# Altium schematic sheet PowerDelivery.SchDoc
size A
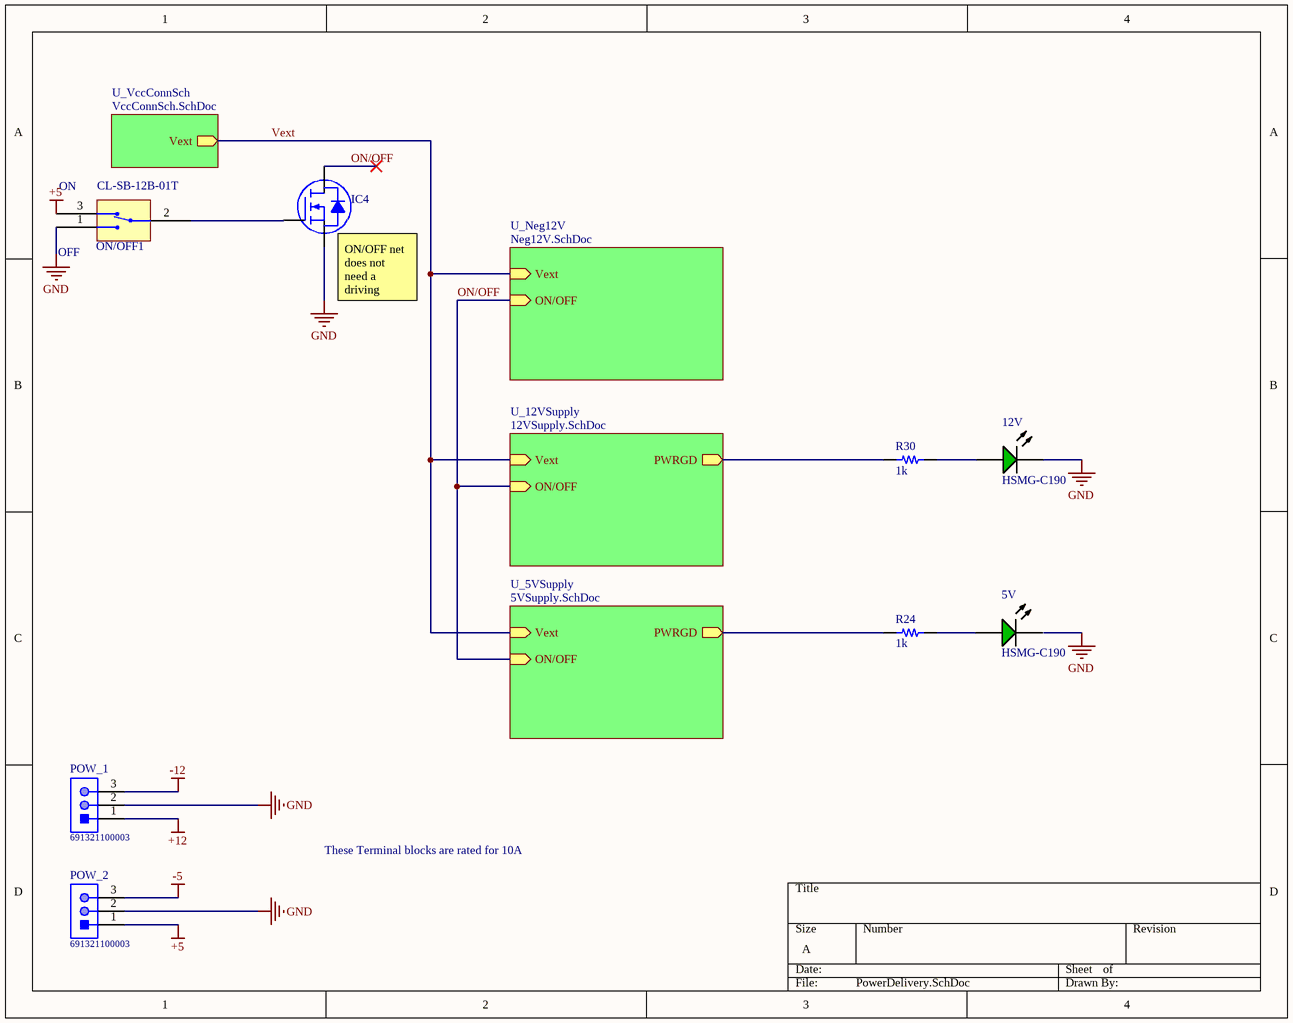
[diagram p0: PowerDelivery.SchDoc]

## Parts
5V  HSMG-C190  [AVAG-HSMX-C190_V]
12V  HSMG-C190  [AVAG-HSMX-C190_V]
IC4  BSS138WH6327XTSA1  [INFINEON SOT-323-3]  (value not drawn)
ON/OFF1  CL-SB-12B-01T  [SW_CL-SB-12B-01]
POW_1  691321100003  [691321100003]
POW_2  691321100003  [691321100003]
R24  1k  [RES 1206/3216]
R30  1k  [RES 1206/3216]

## Sub-sheets
U_5VSupply = 5VSupply.SchDoc: Vext (in), ON/OFF (in), PWRGD (out)
U_12VSupply = 12VSupply.SchDoc: Vext (in), ON/OFF (in), PWRGD (out)
U_Neg12V = Neg12V.SchDoc: Vext (in), ON/OFF (in)
U_VccConnSch = VccConnSch.SchDoc: Vext (out)

## Nets
+5: ON/OFF1.3(GND) POW_2.1
+12: POW_1.1
-5: POW_2.3
-12: POW_1.3
GND: 12V.2(K) IC4.3(S) ON/OFF1.1(GND) POW_1.2 POW_2.2
ON/OFF: IC4.2(D) ; sheet U_Neg12V/ON/OFF, sheet U_12VSupply/ON/OFF, sheet U_5VSupply/ON/OFF
Vext: sheet U_VccConnSch/Vext, sheet U_Neg12V/Vext, sheet U_12VSupply/Vext, sheet U_5VSupply/Vext
Net5V_1: 5V.1(A) R24.1
Net12V_1: 12V.1(A) R30.1
NetIC4_1: IC4.1(G) ON/OFF1.2(GND)
NetR24_2: R24.2 ; sheet U_5VSupply/PWRGD
NetR30_2: R30.2 ; sheet U_12VSupply/PWRGD

Not connected (* = marked no-connect by the designer): 5V 2(K)

## Notes on the sheet
- (near ON/OFF1) ON
- (near ON/OFF1) OFF
- (near IC4) ON/OFF net does not need a driving source since the component has an internal pull up. Check note in Neg5V sch.
- These Terminal blocks are rated for 10A

## Library data of the parts
5V 12V = CMP-1744-00002-1: Chip LED, Green, 2.2 V, -40 to 85 degC, 2-Pin SMD, RoHS, Tape and Reel; Frequency: 400 KHz; Max Supply Voltage: 5.5 V; Access Time: 3500 ns; Clock Frequency: 100 KHz; Case\Package: SOIC; Density: 32 kb; Nominal Supply Current: 2 mA; Interface: Serial; Min Supply Voltage: 1.7 V; Packaging: Tape and Reel; PackageReference: HSMX-C190; ComponentLink2URL: http://docs.avagotech.com/docs/AV02-0551EN; RoHSCompliant: true; Pins: 8; REACH SVHC: No SVHC; Max Operating Temperature: 85 degC; Width: 4 mm; Radiation Hardening: No; Package Quantity: 3000; ComponentLink3Description: Package Specification; ComponentLink1Description: Manufacturer URL; Min Operating Temperature: -40 degC; PackageDescription: 2-Pin Surface Mount Device, Body 1.6 x 0.8 mm, Height 0.9 mm; Max Clock Frequency: 100 KHz; Height: 1.5 mm; ComponentLink1URL: http://www.avagotech.com/; DatasheetVersion: Mar-12; ComponentLink2Description: Datasheet; Mount: Surface Mount; Length: 5 mm; ComponentLink3URL: http://www.fairchildsemi.com/dwg/MA/MA03D.pdf
IC4 = BSS138WH6327XTSA1: MOSFET N-CH 60V 280MA SOT-323; Manufacturer: Infineon Technologies; Rds On (Max) at Id, Vgs: 3.5 Ohm @ 200mA, 10V; Vgs(th) (Max) at Id: 1.4V @ 26uA; Gate Charge (Qg): 1.5nC @ 10V; Input Capacitance (Ciss) at Vds: 43pF @ 25V; Power - Max: 500mW; Current Continuous Drain: 280mA (Ta); Part Number: BSS138WH6327XTSA1; PartId: 8084; Supplier 1: Digi-Key; Supplier Part Number 1: BSS138WH6327XTSA1TR-ND; ComponentLink1Description: Datasheet; ComponentLink1URL: http://www.infineon.com/dgdl/Infineon-BSS138W-DS-v02_43-en.pdf?fileId=db3a304335113a6301351e62fcb4131f; ComponentLink2Description: Digi-Key Listing; ComponentLink2URL: http://www.digikey.com/product-detail/en/BSS138WH6327XTSA1/BSS138WH6327XTSA1TR-ND/5410120; Price: 0.0483; Type: MOSFET N-Channel, Metal Oxide; Device Package: SC-70, SOT-323; Drain to Source Voltage (Vdss): 60V; Features: Logic Level Gate
ON/OFF1 = CL-SB-12B-01T: SWITCH SLIDE SPDT 200MA 12V; Manufacturer: Nidec Copal Electronics; Switch Function: On-On; Actuator Type: Standard; Switch Travel: 2.00mm; Mechanical Life: 10,000 Cycles; Part Number: CL-SB-12B-01T; PartId: 16472; Supplier 1: Digi-Key; Supplier Part Number 1: 563-1318-1-ND; ComponentLink1Description: Datasheet; ComponentLink1URL: https://www.nidec-copal-electronics.com/e/catalog/switch/cl-sb.pdf; ComponentLink2Description: Digi-Key Listing; ComponentLink2URL: https://www.digikey.com/product-detail/en/nidec-copal-electronics/CL-SB-12B-01T/563-1318-1-ND/3507878; Price: 0.9; TYPE: Slide Switches; Series: CL-SB; Circuit: SPDT; Operating Temperature: -40°C ~ 85°C
POW_1 POW_2 = CMP-1502-01784-1: Serie 3211 - 3.50mm Vertical PCB Header WR-TBL, 3 pin; Manufacturer: Wurth Elektronik; Pin Number: 3; Gender: Male; Datasheet URL: http://katalog.we-online.de/em/datasheet/6913211000xx.pdf; Package Reference: 691321100003; Pitch: 3.50mm; Publisher: WurthElektronik; Part Number: 691321100003; Mounting Technology: THT; Packaging: Box; Manufacturer URL: http://www.we-online.de; Operating Temperature: -40to105degC
R24 R30 = ERJ-8ENF1001V: RES SMD 1K OHM 1% 1/4W 1206; Manufacturer: Panasonic Electronic Components; TemperatureRange: -55C ~ 155C; TemperatureCoefficient: 100ppm/C; PowerRating: 0.25W, 1/4W; Value: 1k; Part Number: ERJ-8ENF1001V; PartId: 2958; Supplier 1: Digi-Key; Supplier Part Number 1: P1.00KFTR-ND; ComponentLink1Description: Datasheet; ComponentLink1URL: http://industrial.panasonic.com/www-cgi/jvcr13pz.cgi?E+PZ+3+AOA0002+ERJ8ENF1001V+7+WW; ComponentLink2Description: Digi-Key listing; ComponentLink2URL: http://digikey.com/product-detail/en/ERJ-8ENF1001V/P1.00KFTR-ND/86206; Tolerance: 1%; Price: 0.0093; Type: Thick Film; Device Package: 1206 (3216 Metric)